# Altium schematic sheet bluepill_voltage_reg_pcb.SchDoc
size A
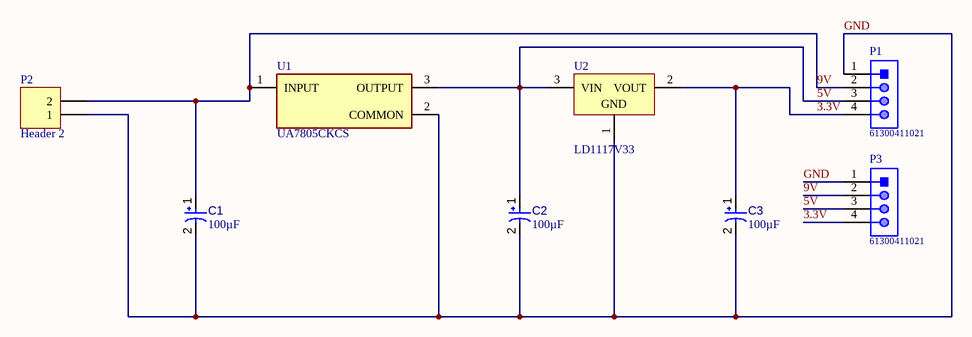
[diagram p0: bluepill_voltage_reg_pcb.SchDoc]

## Parts
C1  value 100µF  [CAPPR65-500-1600X1000X1700]  (hidden comment: ECA-2AM101)
C2  value 100µF  [CAPPR65-500-1600X1000X1700]  (hidden comment: ECA-2AM101)
C3  value 100µF  [CAPPR65-500-1600X1000X1700]  (hidden comment: ECA-2AM101)
P1  61300411021  [61300411021]
P2  Header 2  [HDR1X2]
P3  61300411021  [61300411021]
U1  UA7805CKCS  [FP-KCS0003B-MFG]
U2  LD1117V33  [TO220]

## Nets
3.3V: C3.1 P1.4 P3.4 U2.2(VOUT)
5V: C2.1 P1.3 P3.3 U1.3(OUTPUT) U2.3(VIN)
9V: C1.1 P1.2 P2.2 P3.2 U1.1(INPUT)
GND: C1.2 C2.2 C3.2 P1.1 P2.1 P3.1 U1.2(COMMON) U2.1(GND)

## Library data of the parts
C1-C3 = CMP-001-00034-7: Aluminum Electrolytic Capacitor, 100 uF, +/- 20%, 100 V, -40 to 85 degC, 2-Pin THD, RoHS, Bulk; Manufacturer: Panasonic; Ripple Current (AC): 350mA; Voltage Rating: 100V; Max Operating Temperature: 85°C; Package Quantity: 200; Package Description: 2-Pin Through Hole Device, Dia 10 mm, Body Length 16 mm; Package Reference: CAPPR65-500-1600X1000X1700; Pins: 2; Case/Package: Radial; Datasheet URL: https://industrial.panasonic.com/cdbs/www-data/pdf/RDF0000/ABA0000C1047.pdf; Manufacturer URL: http://www.panasonic.com/; Mounting Technology: TH; Packaging: Bulk; Min Operating Temperature: -40°C; Capacitor Type: Electrolytic; Datasheet Version: Mar-16; RoHS Compliant: True; Tolerance: 20%; Diameter: 10mm; Ripple Current: 350mA; Lead Pitch: 5mm
P1 P3 = CMP-1502-01063-1: THT Angled Pin Header WR-PHD, Pitch 2.54 mm, Single Row, 4 pins; Manufacturer: Wurth Elektronik; Gender: Male; Pin Number: 4; Withstanding Voltage: 500VAC; Working Voltage: 250VAC; Contact Resistance: 20mOhm; Pitch: 2.54mm; Rated Current: 3A; Manufacturer URL: http://www.we-online.de; Mounting Technology: THT; Publisher: WurthElektronik; Operating Temperature: -40to105degC; Packaging: Bag; Row Number: Single; Package Reference: 61300411021; Part Number: 61300411021; Orientation: Angled; Datasheet URL: https://katalog.we-online.de/em/datasheet/6130xx11021.pdf
P2 = Header 2: Header, 2-Pin; LatestRevisionDate: 17-Jul-2002; LatestRevisionNote: Re-released for DXP Platform.; Publisher: Altium Limited
U1 = CMP-04917-000031-1: IC REG LINEAR 5V 1.5A TO220-3; Manufacturer: Texas Instruments; Description: Linear Voltage Regulator IC  1 Output  1.5A TO-220-3; Max Supply Voltage: 25V; Max Junction Temp: +125°C; Output Type: Fixed; Min Supply Voltage: 7V; Dropout Voltage: 2V; Number Of Outputs: 1; Category: IC; Height: 19.65mm; Temperature Range Low: 0°C; Device Class L1: Integrated Circuits (ICs); Manufacturer Part Number: UA7805CKCS; Device Class L3: Voltage Regulators - Linear; Temperature Range High: +125°C; Digikey Description: IC REG LINEAR 5V 1.5A TO220-3; Temperature: 0°C to +125°C; ComponentLink2Description: Datasheet; Lead Free: Yes; Device Class L2: Power Management ICs; Ipc Land Pattern Name: TO-220; Output Current: 1.5A; Output Voltage: 5V; Automotive: No; ComponentLink2URL: http://www.ti.com/lit/ds/symlink/ua78.pdf; Package: KCS0003B; Octopart: https://octopart.com/ua7805ckcs-texas+instruments-525328; Mouser Description: 1.5-A, 40-V, Fixed Positive Linear Regulators 3-TO-220 0 to 125; RoHS: TRUE
U2 = CMP-0244-00470-1: Fixed Low Drop Positive Voltage Regulator, 3.3V, 3-Pin TO-220; PackageVersion: ver3.0; PackageDescription: TO, Thru-Hole, Vertical, Heatsink Mounted; 3 In-Line Leads; Pitch 2.54 mm; ComponentLink1Description: Manufacturer URL; ComponentLink3URL: http://www.st.com/internet/com/TECHNICAL_RESOURCES/TECHNICAL_LITERATURE/PACKAGE_INFORMATION/CD00004649.pdf; PackageReference: TO220; ComponentLink2URL: http://www.st.com/internet/com/TECHNICAL_RESOURCES/TECHNICAL_LITERATURE/DATASHEET/CD00000544.pdf; ComponentLink3Description: Package Specification; ComponentLink2Description: Datasheet; ComponentLink1URL: http://www.st.com; DatasheetVersion: 1/11/2011